# EAGLE schematic Esquema (EAGLE 9.6.2)
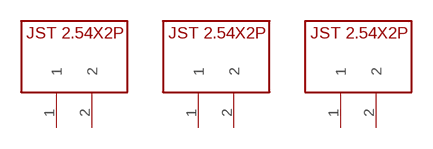
[diagram p0: schematic, sheet 1]

## Parts
U$1  JST2.54X2P  [JST2.54X2P_FOOTPRINT]
U$2  JST2.54X2P  [JST2.54X2P_FOOTPRINT]
U$3  JST2.54X2P  [JST2.54X2P_FOOTPRINT]
Unconnected: U$1.1 U$1.2 U$2.1 U$2.2 U$3.1 U$3.2

## Library data of the parts
U$1-U$3 = CRD:JST2.54X2P: Conector JST 2 pinos (2.54mm de distância entre pinos)